# Altium schematic sheet mainboard_motor.v1.3.SchDoc
size A4
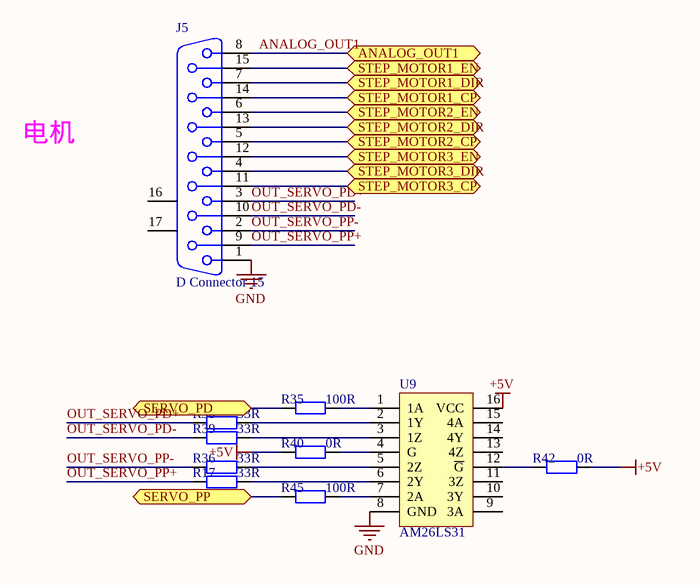
[diagram p0: mainboard_motor.v1.3.SchDoc]

## Parts
J5  D Connector 15  [DSUB1.385-2H15]
R17  33R  [0805]
R35  100R  [0805]
R36  33R  [0805]
R38  33R  [0805]
R39  33R  [0805]
R40  0R  [0805]
R42  0R  [0805]
R45  100R  [0805]
U9  AM26LS31  [SO-16]

## Ports
ANALOG_OUT1, SERVO_PD, SERVO_PP, STEP_MOTOR1_CP, STEP_MOTOR1_DIR, STEP_MOTOR1_EN, STEP_MOTOR2_CP, STEP_MOTOR2_DIR, STEP_MOTOR2_EN, STEP_MOTOR3_CP, STEP_MOTOR3_DIR, STEP_MOTOR3_EN

## Nets
+5V: R40.2 R42.1 U9.16(VCC)
GND: J5.1 U9.8(GND)
ANALOG_OUT1: J5.8 ; port ANALOG_OUT1
OUT_SERVO_PD+: J5.3 R38.2
OUT_SERVO_PD-: J5.10 R39.2
OUT_SERVO_PP+: J5.9 R17.2
OUT_SERVO_PP-: J5.2 R36.2
SERVO_PD: R35.2 ; port SERVO_PD
SERVO_PP: R45.2 ; port SERVO_PP
STEP_MOTOR1_CP: J5.14 ; port STEP_MOTOR1_CP
STEP_MOTOR1_DIR: J5.7 ; port STEP_MOTOR1_DIR
STEP_MOTOR1_EN: J5.15 ; port STEP_MOTOR1_EN
STEP_MOTOR2_CP: J5.5 ; port STEP_MOTOR2_CP
STEP_MOTOR2_DIR: J5.13 ; port STEP_MOTOR2_DIR
STEP_MOTOR2_EN: J5.6 ; port STEP_MOTOR2_EN
STEP_MOTOR3_CP: J5.11 ; port STEP_MOTOR3_CP
STEP_MOTOR3_DIR: J5.4 ; port STEP_MOTOR3_DIR
STEP_MOTOR3_EN: J5.12 ; port STEP_MOTOR3_EN
NetR17_1: R17.1 U9.6(2Y)
NetR35_1: R35.1 U9.1(1A)
NetR36_1: R36.1 U9.5(2Z)
NetR38_1: R38.1 U9.2(1Y)
NetR39_1: R39.1 U9.3(1Z)
NetR40_1: R40.1 U9.4(G)
NetR42_2: R42.2 U9.12(~{G})
NetR45_1: R45.1 U9.7(2A)

Not connected (* = marked no-connect by the designer): J5 16(MH1) 17(MH2); U9 9(3A) 10(3Y) 11(3Z) 13(4Z) 14(4Y) 15(4A)

## Notes on the sheet
- 电机

## Library data of the parts
J5 = D Connector 15: Receptacle Assembly, 15 Position, Right Angle; PackageDocument: O; Positions: 15; Published: 15-Jun-2001; LatestRevisionDate: 17-Jul-2002; LatestRevisionNote: Re-released for DXP Platform.; DatasheetDocument: 1-Sep-99; PackageReference: 788757; Publisher: Altium Limited; Orientation: Right Angle; Gender: Receptacle
R17 R35 R36 R38-R40 R42 R45 = Res2: Resistor; Value: 1K; Published: 8-Jun-2000; LatestRevisionDate: 17-Jul-2002; LatestRevisionNote: Re-released for DXP Platform.; PackageReference: AXIAL-0.4; Publisher: Altium Limited